# Altium schematic sheet 1_P1.schdoc
size 431 x 309 mm; Symbol: Sheet-Symbol_A4; Device: Sheet-Symbol_A4; Company: 嘉立创EDA; Version: V1.0; Page Size: A4; @Project Name: New Project_2024-10-04_14-02-51; @Page Count: 1; @Update Date: 2026-07-02; @Create Date: 2024-10-04; @Schematic Name: Schematic1; @Page No: 1; @Page Name: P1; @Board Name: Board1; @Create Time: 06:02:58; @Update Time: 21:49:01; Width: 1655; Height: 1170; Region Start: 1; X Region Count: 6; Y Region Count: 4; Blade Width: 10; Title Block Position: 3
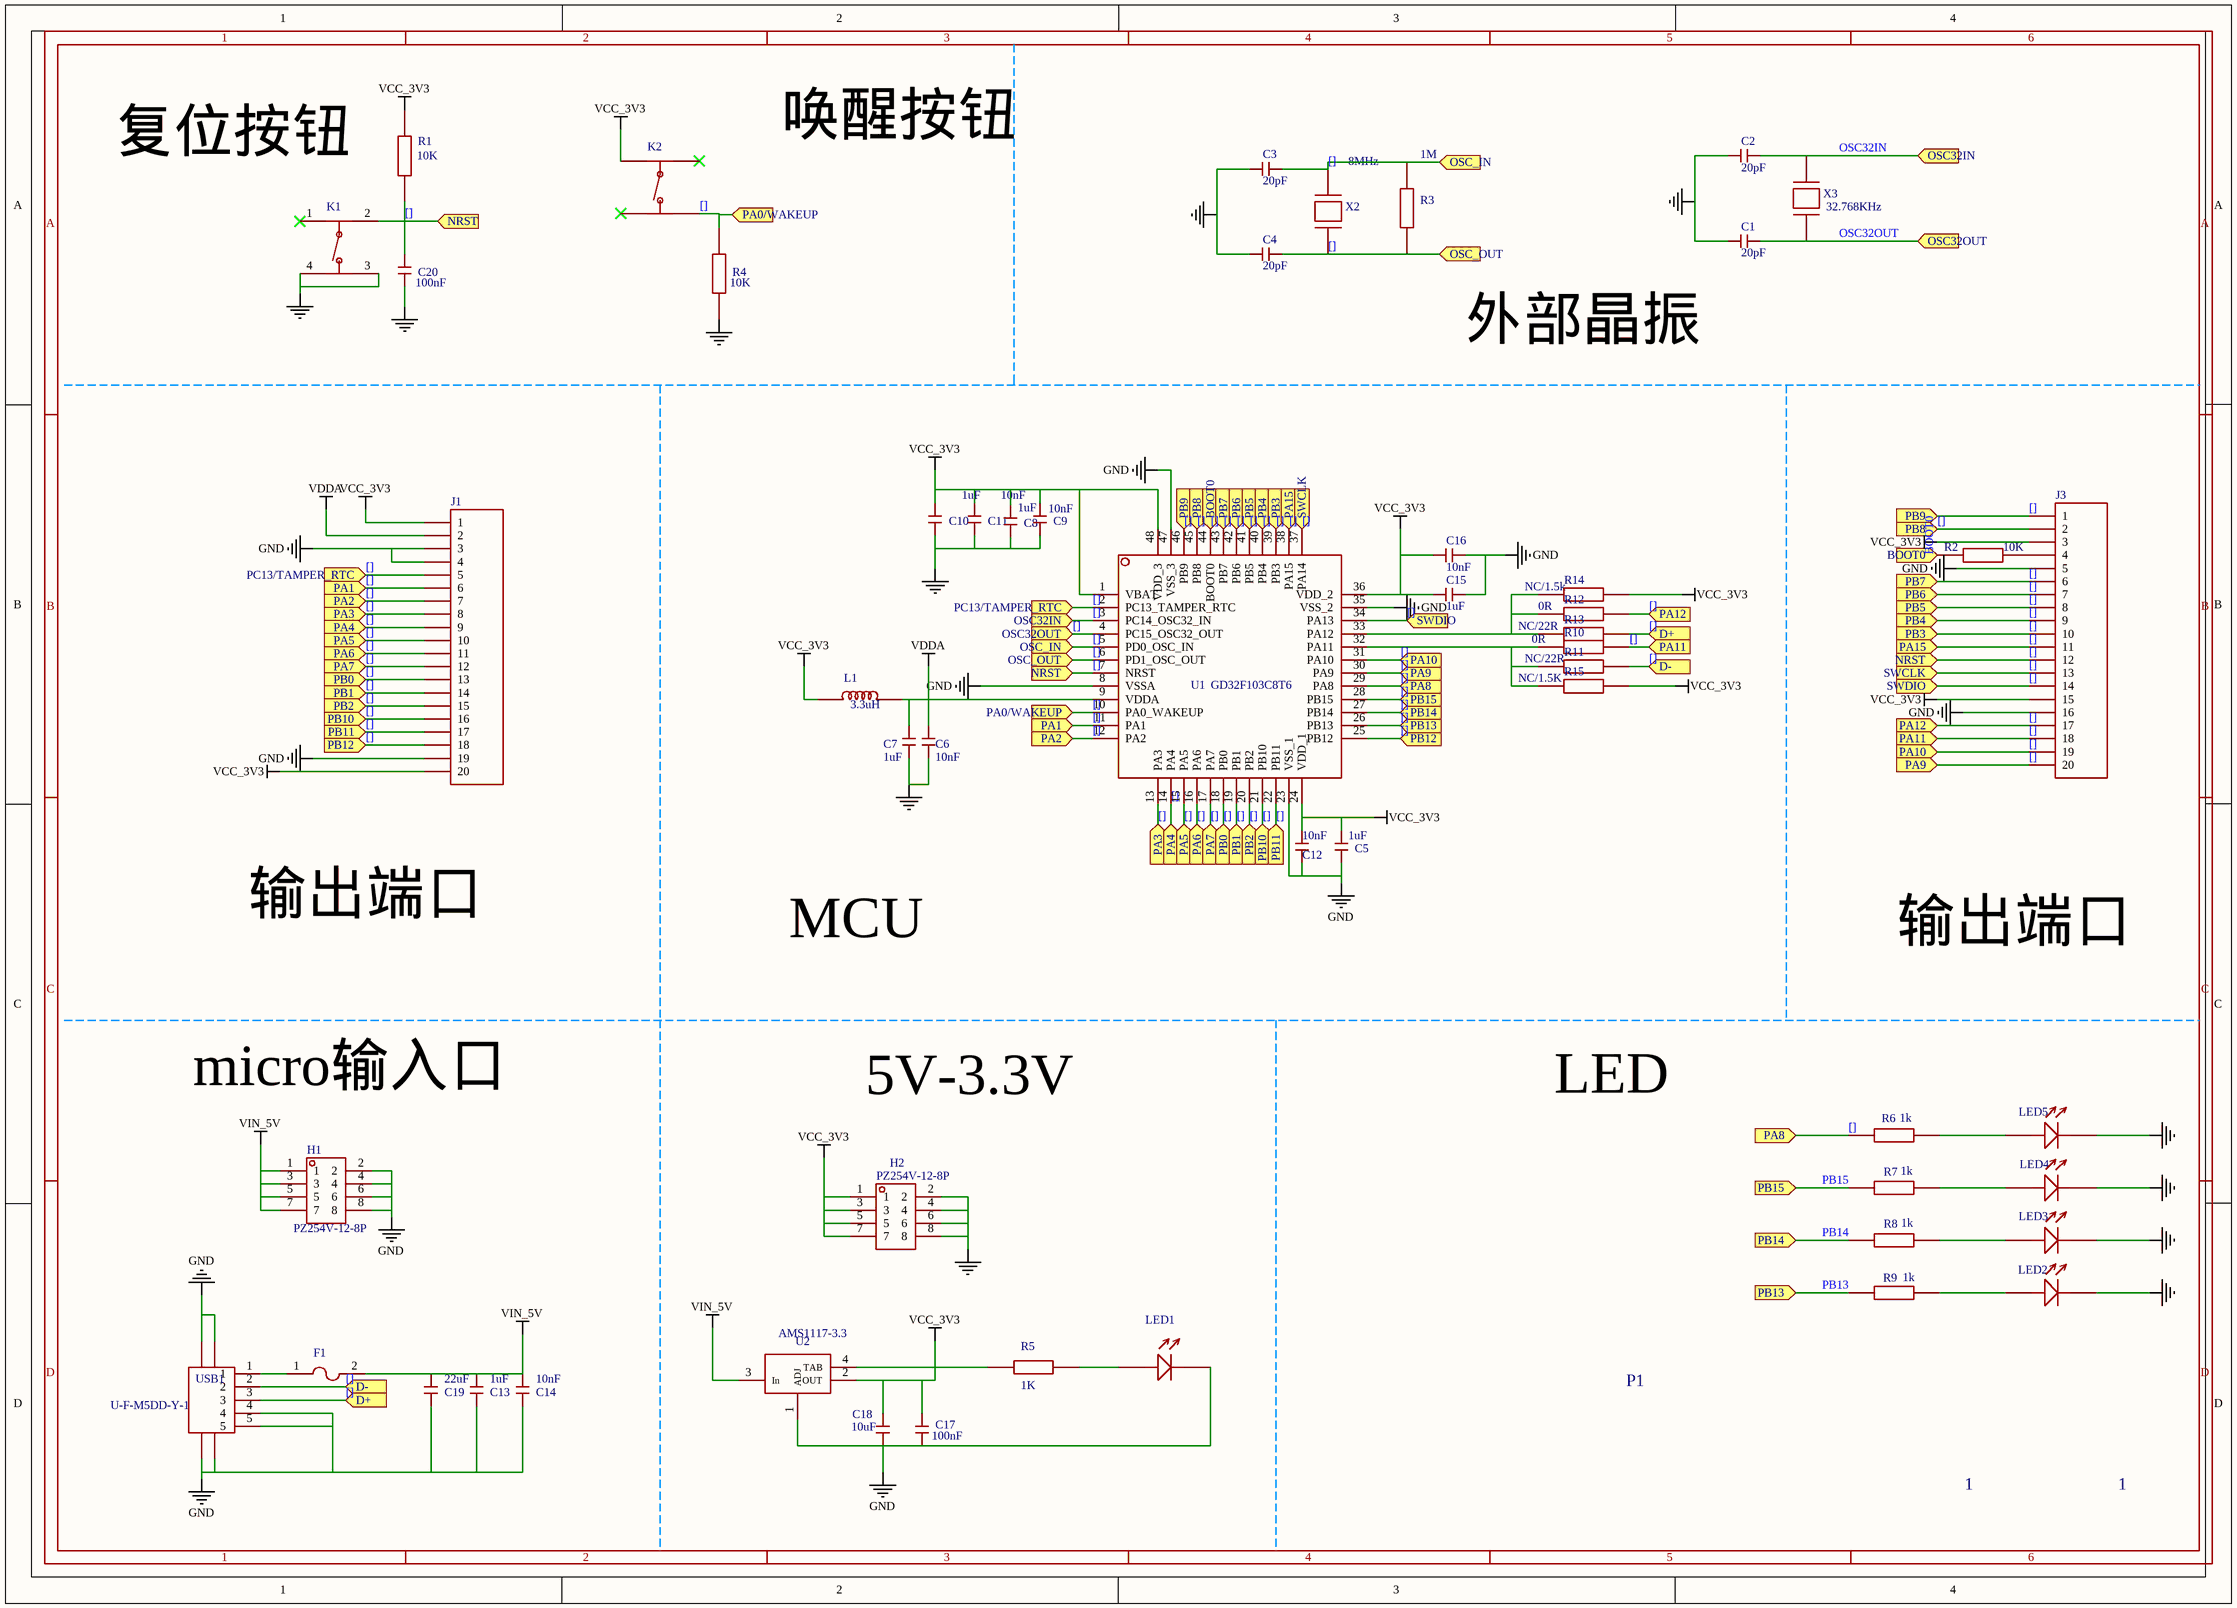
[diagram p0: 1_P1.schdoc]

## Parts
C1  20pF  [C0603]  (value not drawn)
C2  20pF  [C0603]  (value not drawn)
C3  20pF  [C0603]  (value not drawn)
C4  20pF  [C0603]  (value not drawn)
C5  1uF  [C0603]  (value not drawn)
C6  10nF  [C0603]  (value not drawn)
C7  1uF  [C0603]  (value not drawn)
C8  1uF  [C0603]  (value not drawn)
C9  10nF  [C0603]  (value not drawn)
C10  1uF  [C0603]  (value not drawn)
C11  10nF  [C0603]  (value not drawn)
C12  10nF  [C0603]  (value not drawn)
C13  1uF  [C0603]  (value not drawn)
C14  10nF  [C0603]  (value not drawn)
C15  1uF  [C0603]  (value not drawn)
C16  10nF  [C0603]  (value not drawn)
C17  100nF  [C0603]  (value not drawn)
C18  10uF  [C0805]  (value not drawn)
C19  22uF  [C0805]  (value not drawn)
C20  100nF  [C0603]  (value not drawn)
F1  保险丝  [F1210]  (value not drawn)
H1  PZ254V-12-8P  [HDR-TH_8P-P2.54-V-M-R2-C4-S2.54]  (value not drawn)
H2  PZ254V-12-8P  [HDR-TH_8P-P2.54-V-M-R2-C4-S2.54]  (value not drawn)
J1  J  [HDR-TH_20PIN-V-MALE-PITCH2.54]  (value not drawn)
J3  J  [HDR-TH_20PIN-V-MALE-PITCH2.54]  (value not drawn)
K1  开关  [SW-SMD-T6X6-9.5X5.8]  (value not drawn)
K2  开关  [SW-SMD-T6X6-9.5X5.8]  (value not drawn)
L1  3.3uH  [L0603]  (value not drawn)
LED1  LED  [LED]  (value not drawn)
LED2  LED  [LED]  (value not drawn)
LED3  LED  [LED]  (value not drawn)
LED4  LED  [LED]  (value not drawn)
LED5  LED  [LED]  (value not drawn)
R1  10K  [R0603]  (value not drawn)
R2  10K  [R0603]  (value not drawn)
R3  1M  [R0603]  (value not drawn)
R4  10K  [R0603]  (value not drawn)
R5  1K  [R0603]  (value not drawn)
R6  1k  [R0603]  (value not drawn)
R7  1k  [R0603]  (value not drawn)
R8  1k  [R0603]  (value not drawn)
R9  1k  [R0603]  (value not drawn)
R10  0R  [R0603]  (value not drawn)
R11  NC/22R  [R0603]  (value not drawn)
R12  0R  [R0603]  (value not drawn)
R13  NC/22R  [R0603]  (value not drawn)
R14  NC/1.5k  [R0603]  (value not drawn)
R15  NC/1.5K  [R0603]  (value not drawn)
U1  GD32F103C8T6  [TQFP-48_L7.0-W7.0-P0.50-LS9.0-BL]  (value not drawn)
U2  AMS1117-3.3  [SOT-223]  (value not drawn)
USB1  U-F-M5DD-Y-1  [U-F-M5DD-Y-1]  (value not drawn)
X2  8MHz  [OSC-49S-1]  (value not drawn)
X3  32.768KHz  [DT-38_BD3.1-P0.80]  (value not drawn)

## Ports
BOOT0 (in), D+ (in), D- (in), NRST (in), OSC32IN (in), OSC32OUT (in), OSC_IN (in), OSC_OUT (in), PA0/WAKEUP (in), PA1 (in), PA2 (in), PA3 (in), PA4 (in), PA5 (in), PA6 (in), PA7 (in), PA8 (in), PA9 (in), PA10 (in), PA11 (in), PA12 (in), PA15 (in), PB0 (in), PB1 (in), PB2 (in), PB3 (in), PB4 (in), PB5 (in), PB6 (in), PB7 (in), PB8 (in), PB9 (in), PB10 (in), PB11 (in), PB12 (in), PB13 (in), PB14 (in), PB15 (in), PC13/TAMPER_RTC (in), SWCLK (in), SWDIO (in)

## Nets
GND: C1.1 C2.1 C3.1 C4.1 C5.1 C6.1 C7.1 C8.1 C9.1 C10.1 C11.1 C12.1 C13.1 C14.1 C15.1 C16.1 C17.1 C18.1 C19.1 C20.1 H1.2 H1.4 H1.6 H1.8 H2.2 H2.4 H2.6 H2.8 J1.3 J1.4 J1.19 J3.5 J3.16 K1.3 K1.4 LED1.1 LED2.1 LED3.1 LED4.1 LED5.1 R4.1 U1.8(VSSA) U1.23(VSS_1) U1.35(VSS_2) U1.47(VSS_3) U2.1(ADJ) USB1.4 USB1.5 USB1.6 USB1.7 USB1.8 USB1.9
VCC_3V3: C5.2 C8.2 C9.2 C10.2 C11.2 C12.2 C15.2 C16.2 C17.2 C18.2 H2.1 H2.3 H2.5 H2.7 J1.1 J1.20 J3.3 J3.15 K2.3 L1.1 R1.2 R5.1 R14.2 R15.2 U1.1(VBAT) U1.24(VDD_1) U1.36(VDD_2) U1.48(VDD_3) U2.2(OUT) U2.4(TAB)
VDDA: C6.2 C7.2 J1.2 L1.2 U1.9(VDDA)
VIN_5V: C13.2 C14.2 C19.2 F1.2 H1.1 H1.3 H1.5 H1.7 U2.3(In)
[]: C1.2 C2.2 C3.2 C4.2 C20.2 J1.5 J1.6 J1.7 J1.8 J1.9 J1.10 J1.11 J1.12 J1.13 J1.14 J1.15 J1.16 J1.17 J1.18 J3.1 J3.2 J3.6 J3.7 J3.8 J3.9 J3.10 J3.11 J3.12 J3.13 J3.14 J3.17 J3.18 J3.19 J3.20 K1.2 K2.2 R1.1 R2.1 R3.1 R3.2 R4.2 R6.1 R7.1 R8.1 R9.1 R10.2 R11.2 R12.2 R13.2 U1.2(PC13_TAMPER_RTC) U1.3(PC14_OSC32_IN) U1.4(PC15_OSC32_OUT) U1.5(PD0_OSC_IN) U1.6(PD1_OSC_OUT) U1.7(NRST) U1.10(PA0_WAKEUP) U1.11(PA1) U1.12(PA2) U1.13(PA3) U1.14(PA4) U1.15(PA5) U1.16(PA6) U1.17(PA7) U1.18(PB0) U1.19(PB1) U1.20(PB2) U1.21(PB10) U1.22(PB11) U1.25(PB12) U1.26(PB13) U1.27(PB14) U1.28(PB15) U1.29(PA8) U1.30(PA9) U1.31(PA10) U1.34(PA13) U1.37(PA14) U1.38(PA15) U1.39(PB3) U1.40(PB4) U1.41(PB5) U1.42(PB6) U1.43(PB7) U1.44(BOOT0) U1.45(PB8) U1.46(PB9) USB1.2 USB1.3 X2.1 X2.2 X3.1 X3.2 ; port PA8, port PB15, port PB14, port PB13, port D-, port D+, port PB9, port PB8, port BOOT0, port PB7, port PB6, port PB5, port PB4, port PB3, port PA15, port SWCLK, port PA3, port PA4, port PA5, port PA6, port PA7, port PB0, port PB1, port PB2, port PB10, port PB11, port PC13/TAMPER_RTC, port OSC32IN, port OSC32OUT, port OSC_IN, port OSC_OUT, port NRST, port PA0/WAKEUP, port PA1, port PA2, port PB12, port PA9, port PA10, port SWDIO, port PA12, port PA11  [also labelled BOOT0, OSC32IN, OSC32OUT, PB13, PB14, PB15]
NetF1_1: F1.1 USB1.1
NetJ3_4: J3.4 R2.2
NetLED1_2: LED1.2 R5.2
NetLED2_2: LED2.2 R9.2
NetLED3_2: LED3.2 R8.2
NetLED4_2: LED4.2 R7.2
NetLED5_2: LED5.2 R6.2
NetR10_1: R10.1 R11.1 R15.1 U1.32(PA11)
NetR12_1: R12.1 R13.1 R14.1 U1.33(PA12)

Not connected (* = marked no-connect by the designer): K1 1*; K2 1(4)* 4(2)*

## Notes on the sheet
- 复位按钮
- 唤醒按钮
- 外部晶振
- 输出端口
- MCU
- micro输入口
- 5V-3.3V
- LED
- 1
- 2
- 3
- 4
- 5
- 6
- A
- B
- C
- D
- P1

## Library data of the parts
C1-C4 = CC0603JRNPO9BN200: 容值:20pF;精度:±5%;额定电压:50V;材质(温度系数):NP0;; Manufacturer: YAGEO(国巨); Symbol: 电容; Add into BOM: yes; Tolerance: ±5%; Voltage Rated: 50V; Temperature Coefficient: NP0; Device: CC0603JRNPO9BN200; LCSC Part Name: 20pF ±5% 50V; Supplier Part: C105621; Manufacturer Part: CC0603JRNPO9BN200; Supplier Footprint: 0603; JLCPCB Part Class: Extended Part; Datasheet: https://atta.szlcsc.com/upload/public/pdf/source/20170505/1493957838062.pdf; Supplier: LCSC; Convert to PCB: yes; Value: 20pF
C5-C20 = 电容: Add into BOM: yes; Symbol: 电容; Device: 电容; Convert to PCB: yes
F1 = 保险丝: Add into BOM: yes; Symbol: 保险丝; Device: 保险丝; Convert to PCB: yes
H1 H2 = PZ254V-12-8P: Add into BOM: yes; Symbol: PZ254V-12-8P; Device: PZ254V-12-8P; Convert to PCB: yes
J1 J3 = J: Add into BOM: yes; Symbol: J; Device: J; Convert to PCB: yes
K1 K2 = 开关: Add into BOM: yes; Symbol: 开关; Device: 开关; Convert to PCB: yes
L1 = 电感: Add into BOM: yes; Symbol: 电感; Device: 电感; Convert to PCB: yes
LED1-LED5 = LED: Add into BOM: yes; Symbol: LED; Device: LED; Convert to PCB: yes
R1-R15 = 电阻: Add into BOM: yes; Symbol: 电阻; Device: 电阻; Convert to PCB: yes
U1 = GD32F103C8T6: Add into BOM: yes; Symbol: GD32F103C8T6; Device: GD32F103C8T6; Convert to PCB: yes
U2 = AMS1117-3.3: Add into BOM: yes; Symbol: AMS1117-3.3; Device: AMS1117-3.3; Convert to PCB: yes
USB1 = USB: Add into BOM: yes; Symbol: USB; Device: USB; Convert to PCB: yes
X2 X3 = 晶振: Add into BOM: yes; Symbol: 晶振; Device: 晶振; Convert to PCB: yes